# EAGLE design raspberrypi_isp_tool (EAGLE 7.6.0)
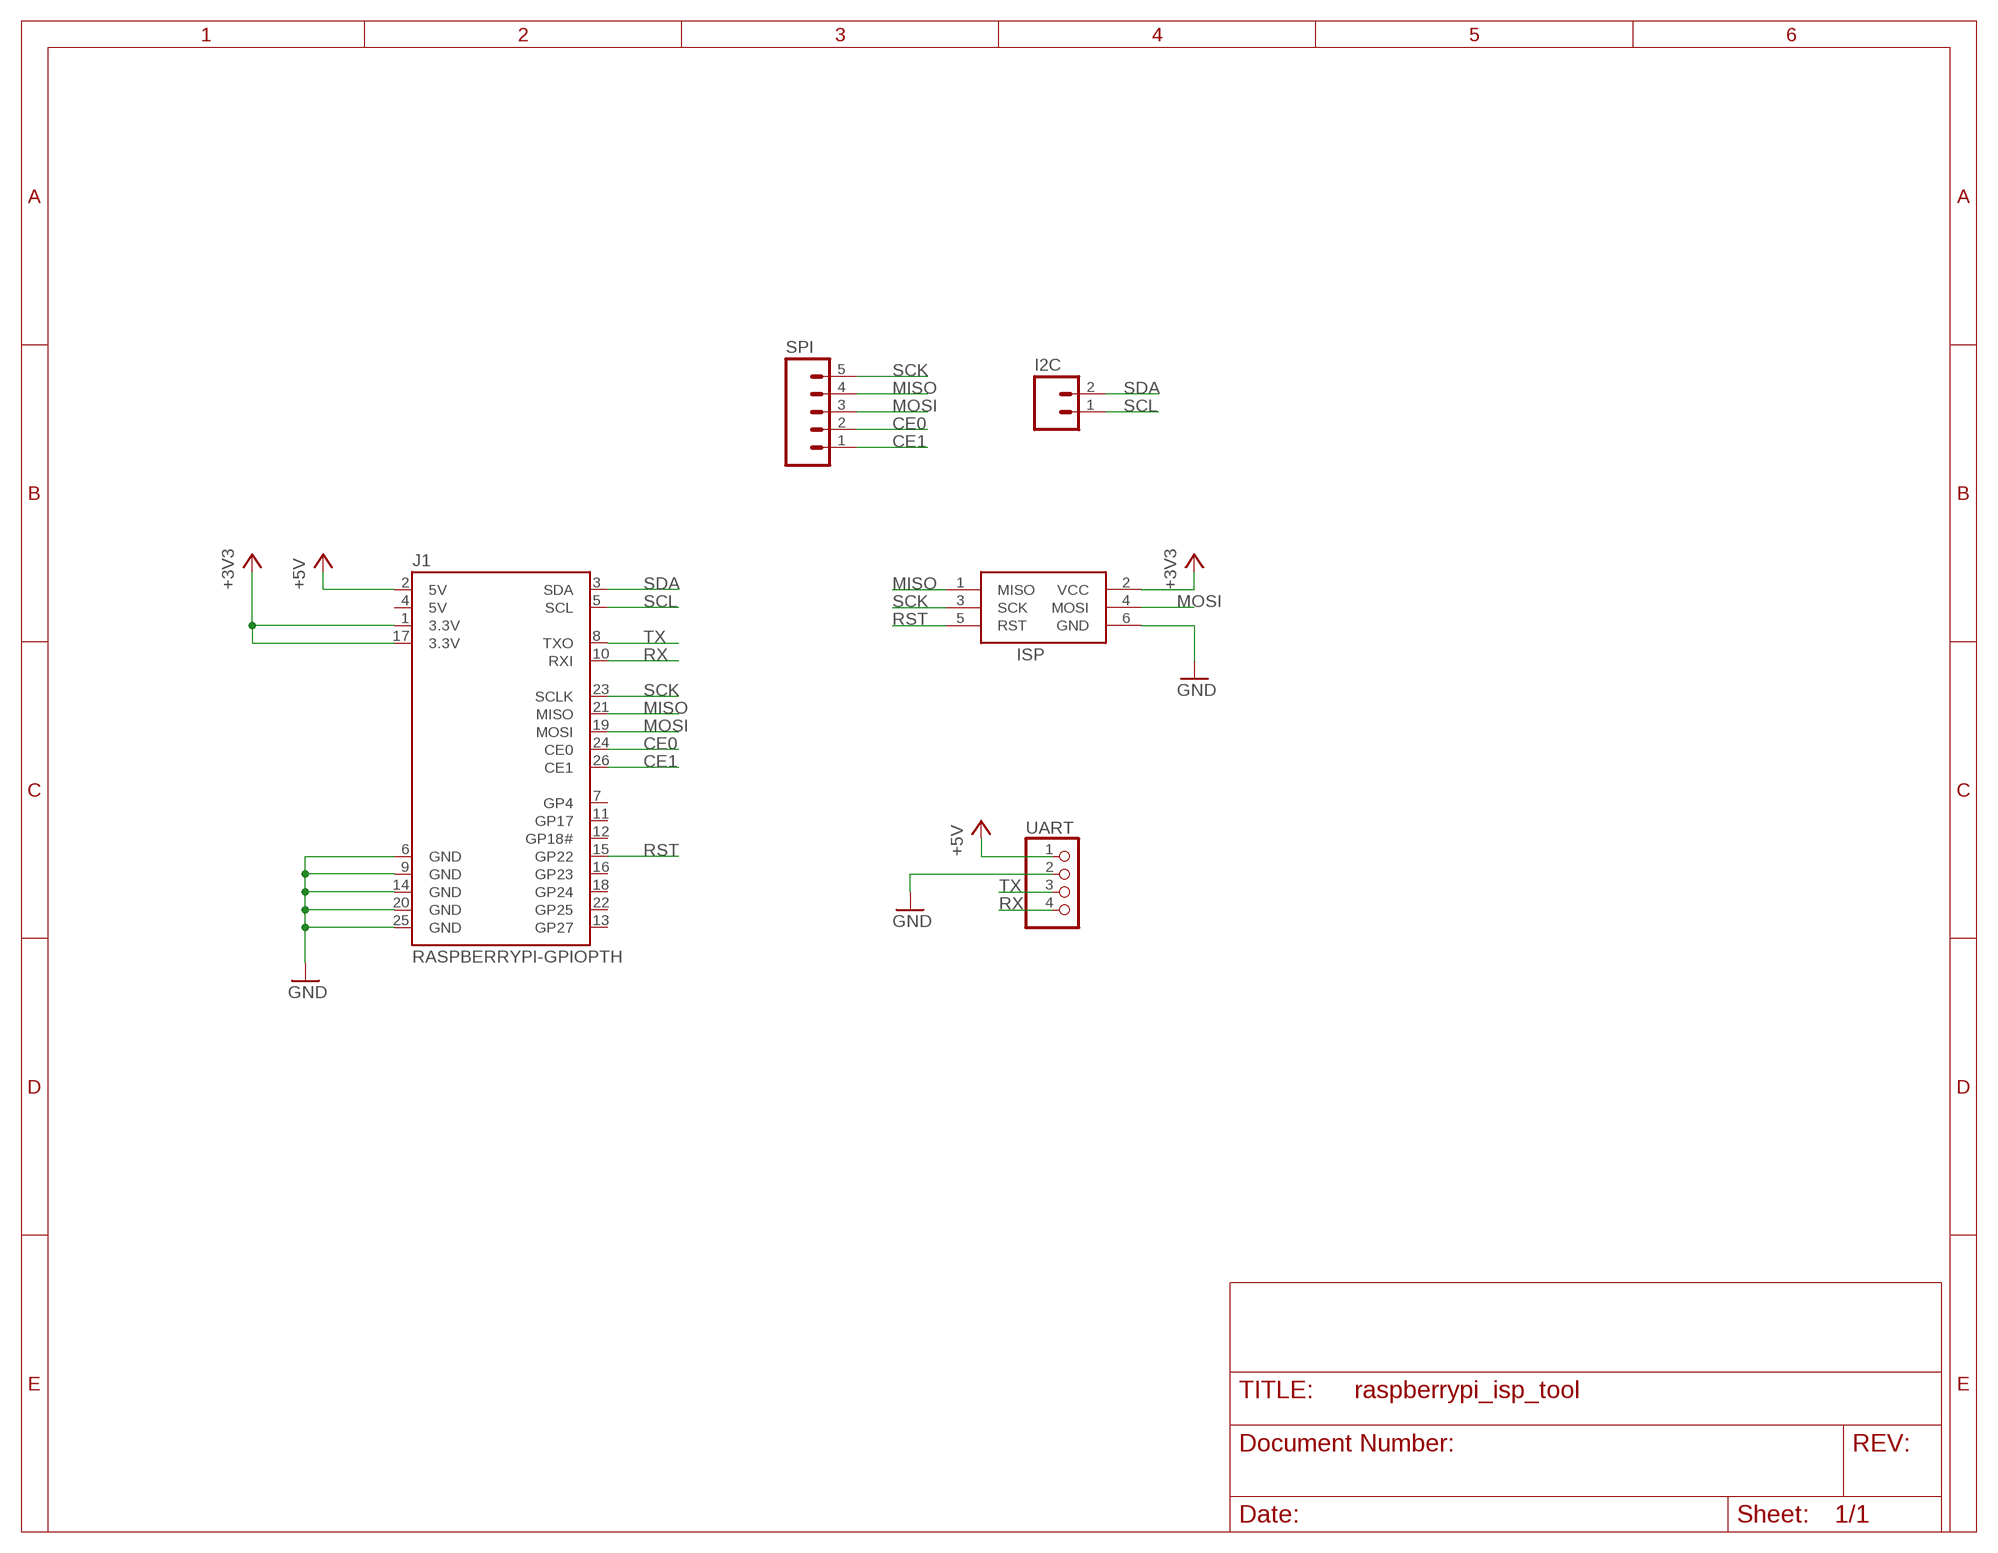
[diagram p0: schematic, sheet 1]

## Parts
I2C  M02PTH  [1X02]
ISP  AVRISP-6  [AVRISP]
J1  RASPBERRYPI-GPIOPTH  [2X13-SHROUDED]
SPI  M05PTH  [1X05]
UART  PINHD-1X4  [1X04]

## Nets
+3V3: ISP.2(VCC) J1.1(3.3V) J1.17(3.3V)
+5V: J1.2(5V) UART.1
CE0: J1.24(CE0) SPI.2
CE1: J1.26(CE1) SPI.1
GND: ISP.6(GND) J1.6(GND) J1.9(GND) J1.14(GND) J1.20(GND) J1.25(GND) UART.2
MISO: ISP.1(MISO) J1.21(MISO) SPI.4
MOSI: ISP.4(MOSI) J1.19(MOSI) SPI.3
RST: ISP.5(RST) J1.15(GP22)
RX: J1.10(RXI) UART.4
SCK: ISP.3(SCK) J1.23(SCLK) SPI.5
SCL: I2C.1 J1.5(SCL)
SDA: I2C.2 J1.3(SDA)
TX: J1.8(TXO) UART.3
Unconnected: J1.7(GP4) J1.11(GP17) J1.12(GP18#) J1.13(GP27) J1.16(GP23) J1.18(GP24) J1.22(GP25)

## Power pins joined to a net without a drawn wire
5V: J1.4(5V)

## Library data of the parts
I2C = SparkFun-Connectors:M02: Standard 2-pin 0.1" header. Use with - straight break away headers ( PRT-00116) - right angle break away headers (PRT-00553) - swiss pins (PRT-00743) - machine pins (PRT-00117) - female headers (PRT-00115) Molex polarized connector foot print use with: PRT-08233 with associated crimp pins and housings. 2.54_SCREWTERM for use with PRT-10571. 3.5mm Screw Terminal footprints for PRT-08084 5mm Screw Terminal footprints for use with PRT-08432
ISP = adafruit:AVRISP: AVR ISP HEADER Standard 6 pin header for AVR programming
J1 = SparkFun-Boards:RASPBERRYPI-GPIO: RASPBERRY PI I/O HEADER As defined for the Revistion 2 Pi.; DIST: sparkfun; DIST_ID: PRT-11490
SPI = SparkFun-Connectors:M05: Header 5 Standard 5-pin 0.1" header. Use with straight break away headers (SKU : PRT-00116), right angle break away headers (PRT-00553), swiss pins (PRT-00743), machine pins (PRT-00117), and female headers (PRT-00115). Molex polarized connector foot print use with SKU : PRT-08230 with associated crimp pins and housings.
UART = pinhead:PINHD-1X4: PIN HEADER

## Board
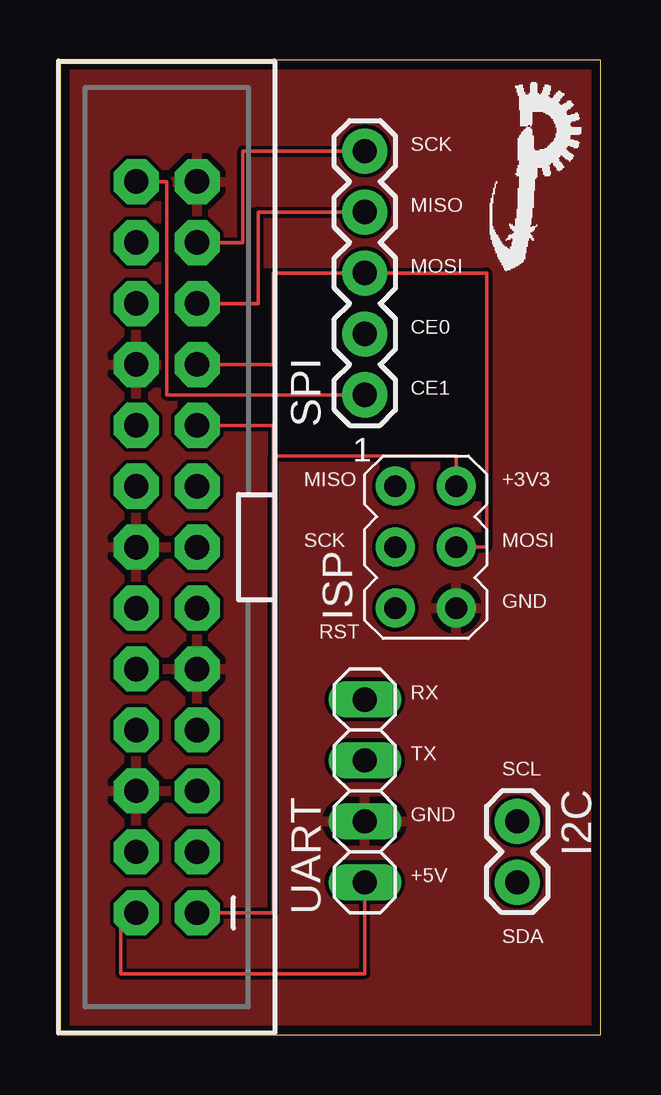
[diagram p1: board, top side]
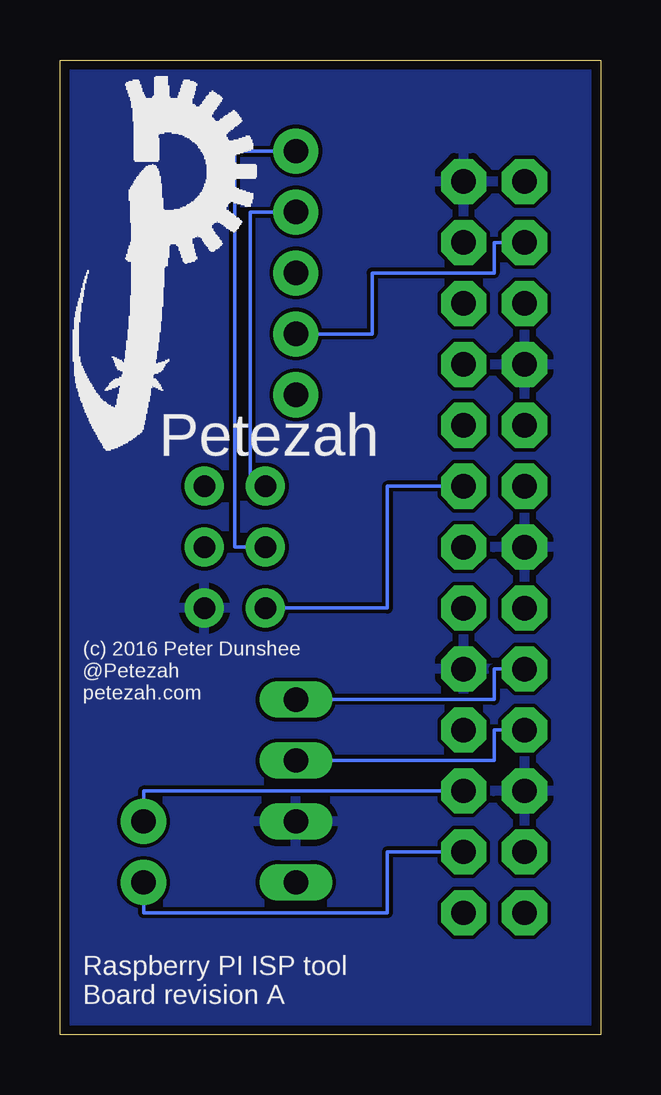
[diagram p2: board, bottom side, seen from below]

Size 22.53 x 40.63 mm. Coordinates in mm from the lower left corner, seen from the top.
Outline: 0,0 22.53,0 22.53,40.63 0,40.63 0,0
Copper layers (1*16): Top 0.0356mm / dielectric 1.5011mm / Bottom 0.0356mm
Design rules "oshpark-2layer": minimum track width 6mil, minimum drill 13mil, track to track 6mil, track to pad 6mil, pad to pad 6mil, via to via 6mil, smd to smd 6mil, copper to edge 15mil, drill to drill 6mil, minimum pad ring 7mil, minimum via ring 7mil, stop-mask expansion 2.5mil, vias tented up to drill 0mil, thermal gap 10mil

### Footprints (pad centres in the part's own frame; a part is rotated, then mirrored left to right if it is on the bottom)
1X02 = drill 1.016 pad 1.88: 1 0,0; 2 2.54,0
AVRISP = drill 0.9 pad 1.626: 1 -1.27,2.54; 2 1.27,2.54; 3 -1.27,0; 4 1.27,0; 5 -1.27,-2.54; 6 1.27,-2.54
2X13-SHROUDED = drill 1.016 pad 1.88 octagon: 1 -1.27,15.24; 2 1.27,15.24; 3 -1.27,12.7; 4 1.27,12.7; 5 -1.27,10.16; 6 1.27,10.16; 7 -1.27,7.62; 8 1.27,7.62; 9 -1.27,5.08; 10 1.27,5.08; 11 -1.27,2.54; 12 1.27,2.54; 13 -1.27,0; 14 1.27,0; 15 -1.27,-2.54; 16 1.27,-2.54; 17 -1.27,-5.08; 18 1.27,-5.08; 19 -1.27,-7.62; 20 1.27,-7.62; 21 -1.27,-10.16; 22 1.27,-10.16; 23 -1.27,-12.7; 24 1.27,-12.7; 25 -1.27,-15.24; 26 1.27,-15.24
1X05 = drill 1.016 pad 1.88: 1 0,0; 2 2.54,0; 3 5.08,0; 4 7.62,0; 5 10.16,0
1X04 = drill 1.016 long: 1 -3.81,0; 2 -1.27,0; 3 1.27,0; 4 3.81,0

### Placement (x,y rotation side)
I2C  19.05,8.89 270 top
ISP  15.24,20.32 0 top
J1  4.45,20.32 180 top
SPI  12.7,26.67 90 top
U$1  [LOGO_TINY]  17.78,31.75 0 top
U$2  [LOGO_SM]  22.23,24.13 0 bottom
UART  12.7,10.16 90 top

### Tracks (layer width: path | path; a pad name or v marks a point on that pad's centre or on a via)
+3V3
  Top 0.152: J1.1 8.89,5.08 8.89,24.13 | 8.89,24.13 16.51,24.13 ISP.2 | J1.17 8.89,25.4 8.89,24.13
+5V
  Top 0.152: J1.2 2.54,5.08 2.54,2.54 12.7,2.54 UART.1
CE0
  Bottom 0.152: J1.24 4.45,33.02 4.45,31.75 9.53,31.75 9.53,29.21 SPI.2
CE1
  Top 0.152: J1.26 4.45,35.56 4.45,26.67 SPI.1
GND
  pour Top: 0,40.64 22.86,40.64 22.86,0 0,0
  pour Bottom: 0,40.64 22.86,40.64 22.86,0 0,0
MISO
  Top 0.152: J1.21 8.26,30.48 8.26,34.29 SPI.4
  Bottom 0.152: ISP.1 14.61,22.86 14.61,34.29 SPI.4
MOSI
  Top 0.152: J1.19 8.89,27.94 8.89,31.75 SPI.3 17.78,31.75 17.78,20.32 ISP.4
RST
  Bottom 0.152: J1.15 8.89,22.86 8.89,17.78 ISP.5
RX
  Bottom 0.152: J1.10 4.45,15.24 4.45,13.97 UART.4
SCK
  Top 0.152: J1.23 7.62,33.02 7.62,36.83 SPI.5
  Bottom 0.152: ISP.3 15.24,20.32 15.24,36.83 SPI.5
SCL
  Bottom 0.152: J1.5 19.05,10.16 I2C.1
SDA
  Bottom 0.152: J1.3 8.89,7.62 8.89,5.08 19.05,5.08 I2C.2
TX
  Bottom 0.152: J1.8 4.45,12.7 4.45,11.43 UART.3

### Text on the board
tPlace: SCK | MISO | MOSI | CE0 | CE1 | MISO | +3V3 | SCK | MOSI | GND | RST | RX | TX | SCL | GND | +5V | SDA
bPlace: Petezah | (c) 2016 Peter Dunshee / @Petezah / petezah.com | Raspberry PI ISP tool / Board revision A